# EAGLE design MTRduino_Rev2.0 (EAGLE 7.0.0)
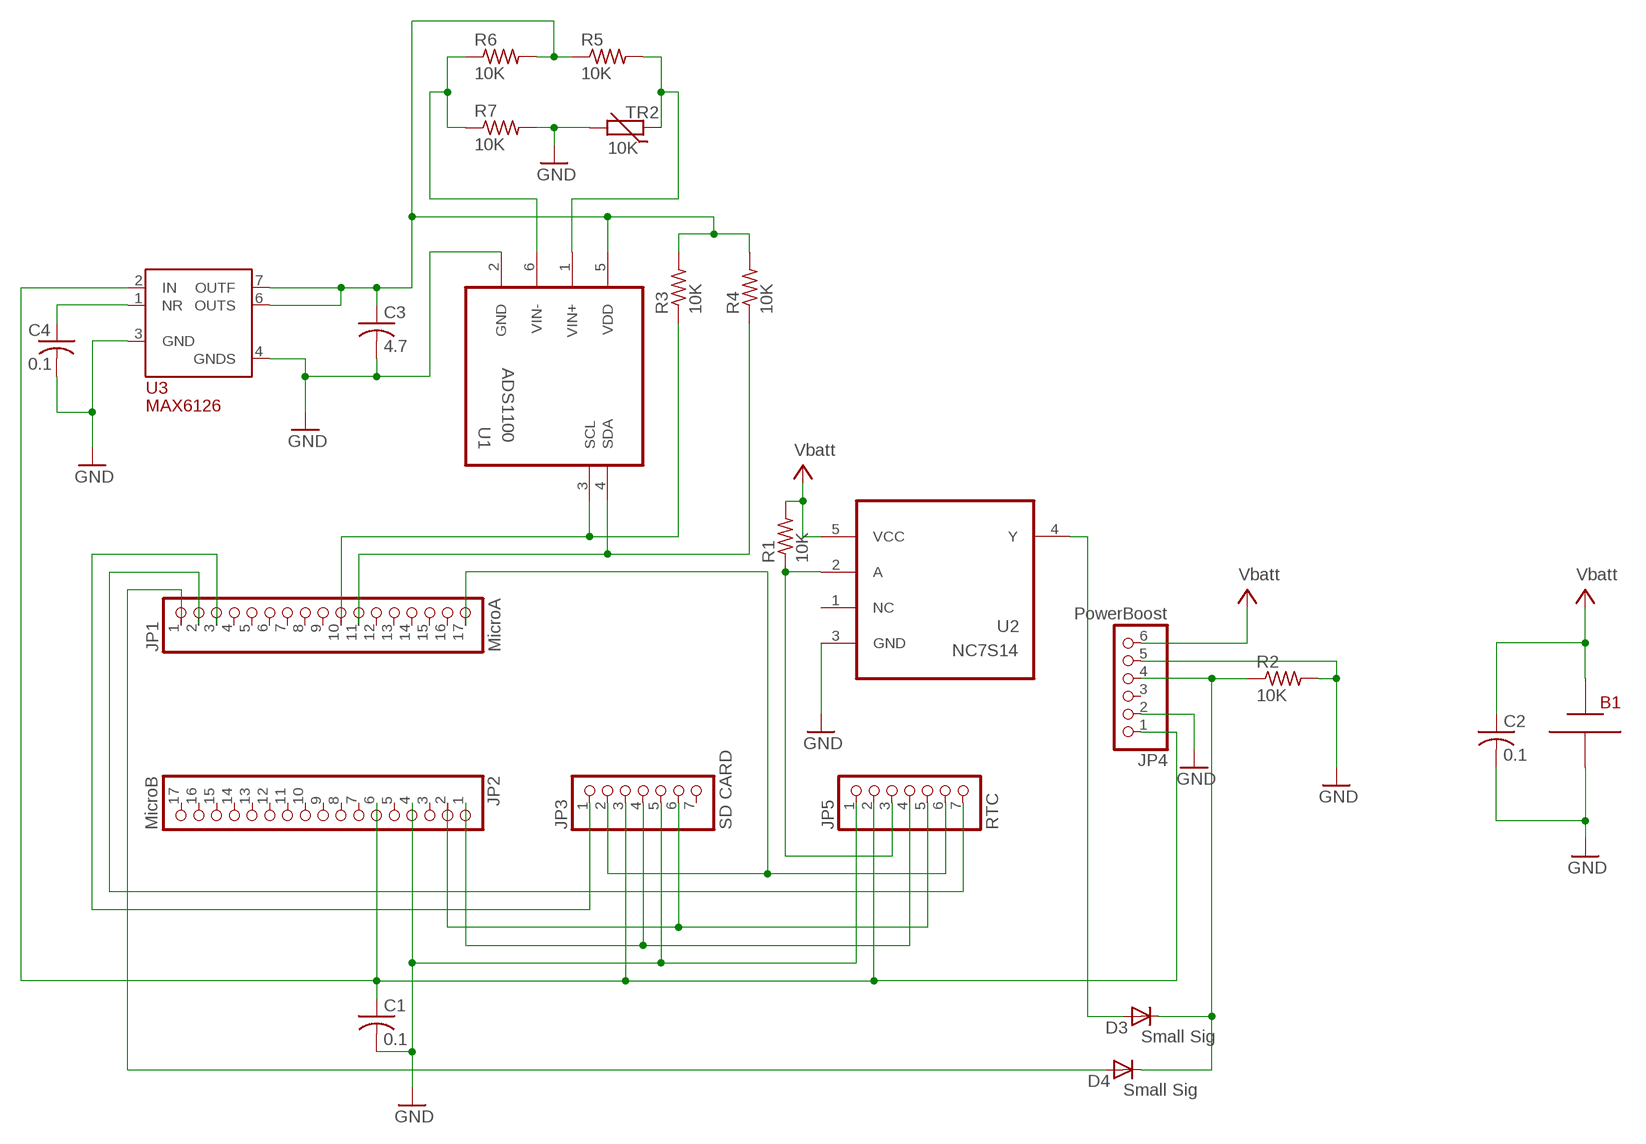
[diagram p0: schematic, sheet 1]

## Parts
B1  2 AA BATT  BATT_AA2  [BATT_AA2]
C1  0.1  C-USC0603  [C0603]
C2  0.1  C-USC0603  [C0603]
C3  4.7  C-USC0603  [C0603]
C4  0.1  C-USC0603  [C0603]
D3  Small Sig  DIODESOD-323F  [SOD-323F]
D4  Small Sig  DIODESOD-323F  [SOD-323F]
JP1  MicroA  PINHD-1X17  [1X17]
JP2  MicroB  PINHD-1X17  [1X17]
JP3  SD CARD  PINHD-1X7  [1X07]
JP4  PowerBoost  PINHD-1X6  [1X06]
JP5  RTC  PINHD-1X7  [1X07]
R1  10K  R-US_R0603  [R0603]
R2  10K  R-US_R0603  [R0603]
R3  10K  R-US_R0603  [R0603]
R4  10K  R-US_R0603  [R0603]
R5  10K  R-US_R0603  [R0603]
R6  10K  R-US_R0603  [R0603]
R7  10K  R-US_R0603  [R0603]
TR2  10K  THERMISTOR_R-5  [R-5]
U1  ADS1100  ADS1100A0IDBVT  [SOT95P280X145-6N]
U2  NC7S14  1P1G14MDBVREPG4  [SOT95P280X145-5N]
U3  MAX6126  [SOIC127P600X175-8N]

## Nets
GND: B1.- C1.2 C2.2 C3.2 C4.2 JP2.4 JP3.5 JP4.2 JP4.5 JP5.1 R2.2 R7.2 TR2.2 U1.2(GND) U2.3(GND) U3.3(GND) U3.4(GNDS)
N$1: D3.A U2.4(Y)
N$3: JP1.2 JP5.7
N$4: C4.1 U3.1(NR)
N$9: JP1.10 R3.1 U1.3(SCL)
N$10: JP1.11 R4.1 U1.4(SDA)
N$14: C3.1 R3.2 R4.2 R5.1 R6.2 U1.5(VDD) U3.6(OUTS) U3.7(OUTF)
N$17: JP5.3 R1.1 U2.2(A)
N$18: JP1.17 JP3.2 JP5.6
N$21: D4.A JP1.1
N$31: D3.C D4.C JP4.4 R2.1
N$35: R6.1 R7.1 U1.6(VIN-)
N$36: R5.2 TR2.1 U1.1(VIN+)
N$37: JP2.1 JP3.4 JP5.4
N$39: JP2.2 JP3.6 JP5.5
N$40: C1.1 JP2.6 JP3.3 JP4.1 JP5.2 U3.2(IN)
N$41: JP1.3 JP3.1
V+: B1.+ C2.1 JP4.6 R1.2 U2.5(VCC) ; supply symbol labelled Vbatt
Unconnected: JP1.4 JP1.5 JP1.6 JP1.7 JP1.8 JP1.9 JP1.12 JP1.13 JP1.14 JP1.15 JP1.16 JP2.3 JP2.5 JP2.7 JP2.8 JP2.9 JP2.10 JP2.11 JP2.12 JP2.13 JP2.14 JP2.15 JP2.16 JP2.17 JP3.7 JP4.3 U2.1(NC)

## Library data of the parts
B1 = adafruit:BATT_AA2
C1-C4 = adafruit:C-US: CAPACITOR, American symbol
D3 D4 = adafruit:DIODE: Diode SMADIODE - SMA Surface Mount Package 20V 1A Schottky Diode Digikey: 641-1014-6-ND DO-1N4148 - Through Hole Small Current Diode SOD-123 20V 1 A (.5mV Vf) Schottky Diode - Digikey: MBRX120TPMSCT-ND SOD-323 10V 570mA (.38mV Vf, 3ns) Schottky Diode - Digikey: ZLLS410CT-ND SOD-523 30V 30mA Schottky Diode (RB751S-40TE61) - Digikey: RB751S-40TE61CT-ND SOT23-R/W - SOT23 Package (R = Solder Paste/Reflow Ovens, W = Hand-Soldering) BAT54Film 40V 300mA - Digikey: 497-7162-1-ND
JP1 JP2 = pinhead:PINHD-1X17: PIN HEADER
JP3 JP5 = pinhead:PINHD-1X7: PIN HEADER
JP4 = pinhead:PINHD-1X6: PIN HEADER
R1-R7 = resistor:R-US_: RESISTOR, American symbol
TR2 = discrete:THERMISTOR_: Thermo Resistor
U1 = Texas Instruments_By_element14_Batch_1:ADS1100A0IDBVT: Self-Calibrating, 16-Bit ANALOG-TO-DIGITAL CONVERTER; MPN: ADS1100A0IDBVT; OC_FARNELL: 1135959; OC_NEWARK: 20H0708; PACKAGE: SOT-23-6; SUPPLIER: Texas Instruments
U2 = Texas Instruments_By_element14_Batch_1:1P1G14MDBVREPG4: SINGLE SCHMITT-TRIGGER INVERTER; MPN: 1P1G14MDBVREPG4; OC_FARNELL: -; OC_NEWARK: 56P2415; PACKAGE: SOT-23-5; SUPPLIER: Texas Instruments
U3 = Maxim_By_element14_Batch_1:MAX6126

## Board
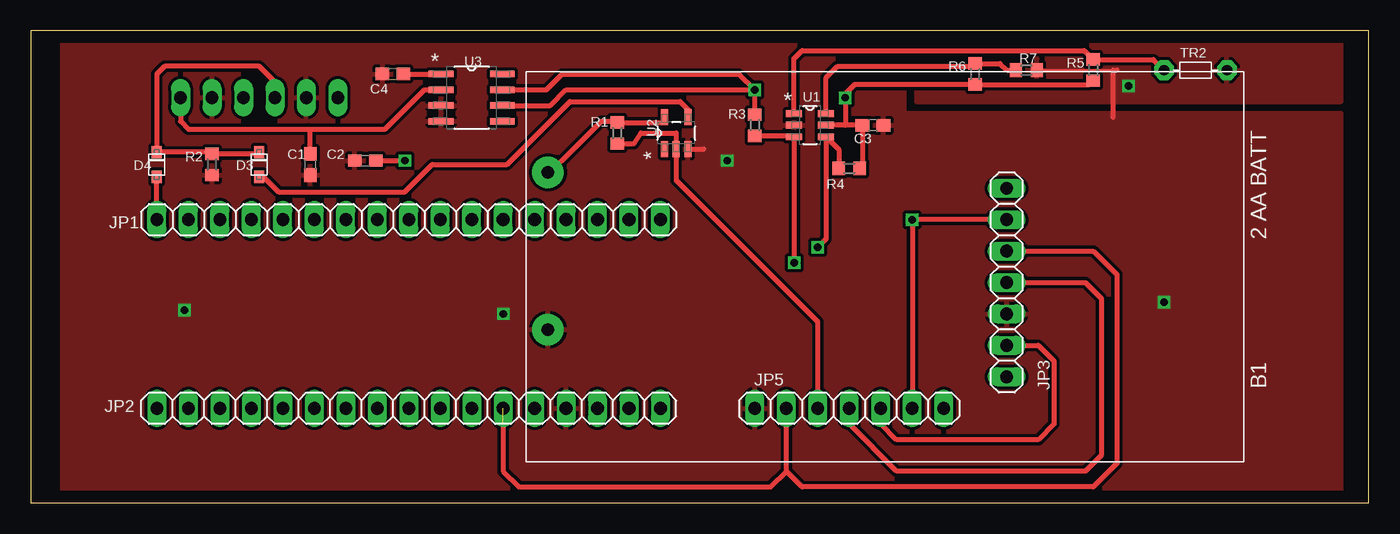
[diagram p1: board, top side]
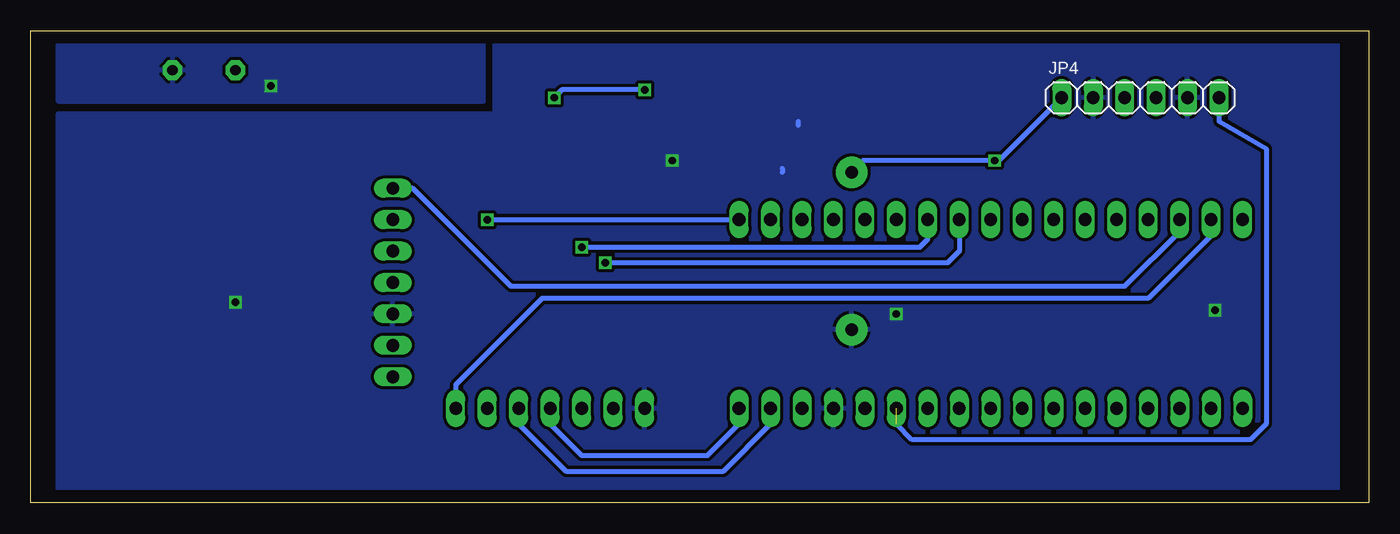
[diagram p2: board, bottom side, seen from below]

Size 107.94 x 38.09 mm. Coordinates in mm from the lower left corner, seen from the top.
Outline: 0,0 107.94,0 107.94,38.09 0,38.09 0,0
Copper layers (1*16): Top 0.035mm / dielectric 1.5mm / Bottom 0.035mm
Design rules "default *": minimum track width 10mil, minimum drill 20mil, track to track 8mil, track to pad 8mil, pad to pad 8mil, via to via 8mil, smd to smd 8mil, copper to edge 40mil, drill to drill 8mil, minimum pad ring 10mil, minimum via ring 8mil, stop-mask expansion 4mil, vias tented up to drill 0mil, thermal gap 10mil

### Footprints (pad centres in the part's own frame; a part is rotated, then mirrored left to right if it is on the bottom)
BATT_AA2 = drill 1 pad 2.54: + -27.178,7.62; - -27.178,-5.08
C0603 = smd 1.1 x 1: 1 -0.85,0; 2 0.85,0
SOD-323F = smd 1 x 0.8: A -1,0; C 1,0
1X17 = drill 1.016 long: 1 -20.32,0; 2 -17.78,0; 3 -15.24,0; 4 -12.7,0; 5 -10.16,0; 6 -7.62,0; 7 -5.08,0; 8 -2.54,0; 9 0,0; 10 2.54,0; 11 5.08,0; 12 7.62,0; 13 10.16,0; 14 12.7,0; 15 15.24,0; 16 17.78,0; 17 20.32,0
1X07 = drill 1.016 long: 1 -7.62,0; 2 -5.08,0; 3 -2.54,0; 4 0,0; 5 2.54,0; 6 5.08,0; 7 7.62,0
1X06 = drill 1.016 long: 1 -6.35,0; 2 -3.81,0; 3 -1.27,0; 4 1.27,0; 5 3.81,0; 6 6.35,0
R0603 = smd 1 x 1.1: 1 -0.85,0; 2 0.85,0
R-5 = drill 0.813 pad 1.6 octagon: 1 -2.54,0; 2 2.54,0
SOT95P280X145-6N = smd 1.27 x 0.559: 1 -1.295,0.94; 2 -1.295,0; 3 -1.295,-0.94; 4 1.295,-0.94; 5 1.295,0; 6 1.295,0.94
SOT95P280X145-5N = smd 1.27 x 0.559: 1 -1.295,0.94; 2 -1.295,0; 3 -1.295,-0.94; 4 1.295,-0.94; 5 1.295,0.94
SOIC127P600X175-8N = smd 1.981 x 0.533: 1 -2.464,1.905; 2 -2.464,0.635; 3 -2.464,-0.635; 4 -2.464,-1.905; 5 2.464,-1.905; 6 2.464,-0.635; 7 2.464,0.635; 8 2.464,1.905

### Placement (x,y rotation side)
B1  68.9,19.05 0 top
C1  22.54,27.3 270 top
C2  26.99,27.62 180 top
C3  67.94,30.48 0 top
C4  29.21,34.61 180 top
D3  18.41,27.3 90 top
D4  10.16,27.3 90 top
JP1  30.48,22.86 0 top
JP2  30.48,7.62 180 top
JP3  78.74,17.78 270 top
JP4  18.41,32.7 180 bottom
JP5  66.04,7.62 0 top
R1  47.31,29.84 90 top
R2  14.61,27.3 270 top
R3  58.42,30.48 90 top
R4  66.04,26.99 0 top
R5  85.72,34.92 90 top
R6  76.2,34.61 270 top
R7  80.33,34.92 0 top
TR2  93.98,34.92 0 top
U1  62.87,30.48 0 top
U2  52.07,29.84 90 top
U3  35.56,32.7 0 top

### Tracks (layer width: path | path; a pad name or v marks a point on that pad's centre or on a via)
GND  (via drill 0.6)
  Top 0.254: R7.2 87.31,34.92
  Top 0.406: 87.63,34.92 87.31,34.92 87.31,31.11 | U2.3 54.27,28.55 54.29,28.57
  Bottom 0.406: 46.04,30.8 46.04,30.48 | 47.31,26.99 47.31,26.67
  other vias: 56.2,27.62 12.38,15.56 91.44,16.19 88.58,33.66 38.1,15.24
  pour Top (isolate 0.254): 2.54,38.42 2.54,-0.95 105.73,-0.95 105.73,31.43 70.48,31.43 70.48,39.37
  pour Bottom (isolate 0.254): 2.54,40.32 2.54,-0.95 105.73,-0.95 105.73,31.43 70.48,31.43 70.48,40.32
  pour Bottom (isolate 0.254): 71.44,32.38 105.73,32.38 105.73,39.69 71.44,39.69
  pour Top (isolate 0.254): 71.44,39.69 71.44,32.38 105.73,32.38 105.73,39.69
N$1
  Top 0.406: D3.A 18.78,26.3 20,25.08 30.16,25.08 32.38,27.3 38.42,27.3 43.5,32.38 52.39,32.38 53.02,31.75 53.02,31.15 U2.4
N$3
  Bottom 0.406: JP1.2 12.7,21.59 17.78,16.51 66.67,16.51 73.66,9.53 JP5.7
N$4
  Top 0.406: C4.1 U3.1
N$9  (via drill 0.6)
  Top 0.406: U1.3 61.58,29.54 61.59,29.53 | R3.1 61.48,29.63 U1.3 | v61.59,19.37 61.59,29.52 U1.3
  Bottom 0.406: JP1.10 33.02,20.32 33.97,19.37 v61.59,19.37
N$10  (via drill 0.6)
  Top 0.406: R4.1 65.19,28.51 U1.4 64.16,21.3 v63.5,20.64
  Bottom 0.406: v63.5,20.64 36.2,20.64 35.56,21.27 JP1.11
N$14  (via drill 0.6)
  Top 0.406: R4.2 67.09,27.19 C3.1 65.72,30.48 | 65.72,30.48 U1.5 | 65.72,30.48 v65.72,32.7 65.72,33.02 66.46,33.76 R6.2 85.41,33.76 R5.1 | U3.6 41.91,32.07 43.18,33.34 v58.42,33.34 | U3.7 41.59,33.34 42.86,34.61 57.15,34.61 v58.42,33.34 | R3.2 v58.42,33.34
  Bottom 0.406: v58.42,33.34 65.09,33.34 v65.72,32.7
N$17
  Top 0.406: R1.1 48.68,29 49.21,29.84 52.07,29.84 U2.2 52.07,26.04 63.5,14.61 JP5.3
N$18  (via drill 0.6)
  Top 0.406: JP3.2 v71.12,22.86 JP5.6
  Bottom 0.406: v71.12,22.86 JP1.17
N$21
  Top 0.406: JP1.1 D4.A
N$31
  Top 0.406: D3.C 18.27,28.16 R2.1 14.46,28.3 D4.C 10.16,34.61 10.79,35.24 18.41,35.24 19.68,33.97 JP4.4
N$35
  Top 0.406: R6.1 78.21,35.46 78.74,34.92 R7.1 | 76.1,35.56 R6.1 | U1.6 64.16,34.31 65.09,35.24 75.98,35.24 R6.1
N$36
  Top 0.406: U1.1 61.57,35.85 62.23,36.51 84.99,36.51 R5.2 90.59,35.77 TR2.1
N$37
  Top 0.406: JP3.4 85.09,17.78 86.36,16.51 86.36,3.81 85.09,2.54 69.85,2.54 66.04,6.35 JP5.4
  Bottom 0.406: JP5.4 66.04,6.35 63.5,3.81 53.34,3.81 50.8,6.35 JP2.1
N$39
  Top 0.406: JP3.6 81.28,12.7 82.55,11.43 82.55,6.35 81.28,5.08 69.85,5.08 68.58,6.35 JP5.5
  Bottom 0.406: JP5.5 68.58,6.35 64.77,2.54 52.07,2.54 48.26,6.35 JP2.2
N$40  (1 unrouted)
  Top 0.406: JP2.6 38.1,2.54 39.37,1.27 59.69,1.27 60.96,2.54 | 60.96,2.54 JP5.2 | JP3.3 85.72,20.32 87.63,18.41 87.63,3.17 85.72,1.27 62.23,1.27 60.96,2.54 | JP4.1 12.06,30.8 12.7,30.16 22.54,30.16 | C1.1 22.54,30.16 | 22.54,30.16 28.57,30.16 31.75,33.34 U3.2
  Bottom 0.406: JP4.1 12.06,30.8 8.26,28.57 8.26,6.35 9.53,5.08 36.83,5.08 38.1,6.35
N$41
  Bottom 0.406: JP1.3 15.24,21.91 19.68,17.46 69.22,17.46 77.15,25.4 JP3.1
V+  (via drill 0.6)
  Top 0.406: U2.5 51,30.7 R1.2 47.2,30.8 46.04,30.8 42.86,27.62 B1.+ | C2.1 v30.16,27.62
  Bottom 0.406: JP4.6 29.84,27.62 v30.16,27.62 30.48,27.62 40.77,27.62 B1.+

### Text on the board
tValues: CS | DI | VCC | 12 | 11 | 10 | 9 | 8 | 7 | 6 | 5 | 4 | 3 | 2 | RS | RX | TX | SS | GND | SCK | MOSI | GND | DO | CD | 13 | 3V | AREF | A0 | A1 | A2 | A3 | A4 | A5 | NC | NC | +5V | RS | VIN | MISO | SCK | GND | SS | GND | VCC | CLK | SQW | MISO | MOSI
bValues: 5V | LB | EN | GND | GND | BAT